# Altium schematic sheet Current_Sensing.SchDoc
size A4; SheetNumber: 6; SheetTotal: 8
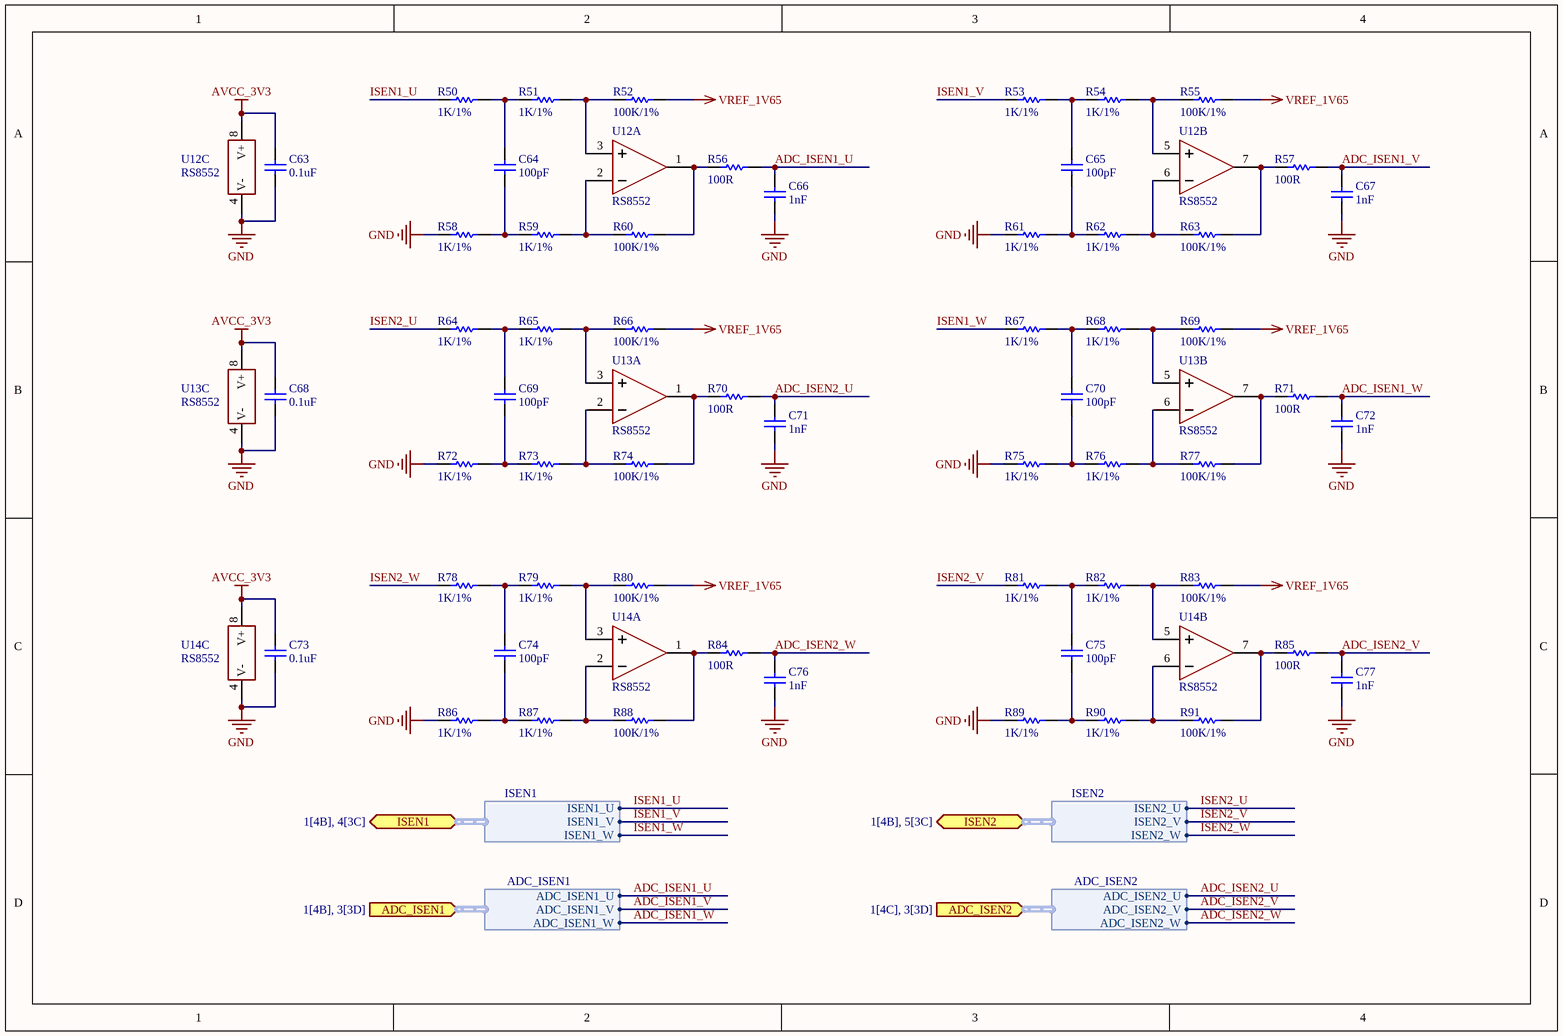
[diagram p0: Current_Sensing.SchDoc]

## Parts
C63  0.1uF  [C0603_NS]
C64  100pF  [C0603_NS]
C65  100pF  [C0603_NS]
C66  1nF  [C0603_NS]
C67  1nF  [C0603_NS]
C68  0.1uF  [C0603_NS]
C69  100pF  [C0603_NS]
C70  100pF  [C0603_NS]
C71  1nF  [C0603_NS]
C72  1nF  [C0603_NS]
C73  0.1uF  [C0603_NS]
C74  100pF  [C0603_NS]
C75  100pF  [C0603_NS]
C76  1nF  [C0603_NS]
C77  1nF  [C0603_NS]
R50  1K/1%  [R0603_NS]
R51  1K/1%  [R0603_NS]
R52  100K/1%  [R0603_NS]
R53  1K/1%  [R0603_NS]
R54  1K/1%  [R0603_NS]
R55  100K/1%  [R0603_NS]
R56  100R  [R0603_NS]
R57  100R  [R0603_NS]
R58  1K/1%  [R0603_NS]
R59  1K/1%  [R0603_NS]
R60  100K/1%  [R0603_NS]
R61  1K/1%  [R0603_NS]
R62  1K/1%  [R0603_NS]
R63  100K/1%  [R0603_NS]
R64  1K/1%  [R0603_NS]
R65  1K/1%  [R0603_NS]
R66  100K/1%  [R0603_NS]
R67  1K/1%  [R0603_NS]
R68  1K/1%  [R0603_NS]
R69  100K/1%  [R0603_NS]
R70  100R  [R0603_NS]
R71  100R  [R0603_NS]
R72  1K/1%  [R0603_NS]
R73  1K/1%  [R0603_NS]
R74  100K/1%  [R0603_NS]
R75  1K/1%  [R0603_NS]
R76  1K/1%  [R0603_NS]
R77  100K/1%  [R0603_NS]
R78  1K/1%  [R0603_NS]
R79  1K/1%  [R0603_NS]
R80  100K/1%  [R0603_NS]
R81  1K/1%  [R0603_NS]
R82  1K/1%  [R0603_NS]
R83  100K/1%  [R0603_NS]
R84  100R  [R0603_NS]
R85  100R  [R0603_NS]
R86  1K/1%  [R0603_NS]
R87  1K/1%  [R0603_NS]
R88  100K/1%  [R0603_NS]
R89  1K/1%  [R0603_NS]
R90  1K/1%  [R0603_NS]
R91  100K/1%  [R0603_NS]
U12  RS8552  [TSSOP8_N]  (parts A,B,C of 3)
U13  RS8552  [TSSOP8_N]  (parts A,B,C of 3)
U14  RS8552  [TSSOP8_N]  (parts A,B,C of 3)

## Ports
ADC_ISEN1 (in, harness ADC_ISEN1, see 1[4B], 3[3D]), ADC_ISEN2 (in, harness ADC_ISEN2, see 1[4C], 3[3D]), ISEN1 (bidir, harness ISEN1, see 1[4B], 4[3C]), ISEN2 (bidir, harness ISEN2, see 1[4B], 5[3C])

## Harnesses
ISEN1: ISEN1_U, ISEN1_V, ISEN1_W
ISEN2: ISEN2_U, ISEN2_V, ISEN2_W
ADC_ISEN1: ADC_ISEN1_W, ADC_ISEN1_V, ADC_ISEN1_U
ADC_ISEN2: ADC_ISEN2_W, ADC_ISEN2_V, ADC_ISEN2_U

## Nets
AVCC_3V3: C63.2 C68.2 C73.2 U12.8(V+) U13.8(V+) U14.8(V+)
GND: C63.1 C66.1 C67.1 C68.1 C71.1 C72.1 C73.1 C76.1 C77.1 R58.1 R61.1 R72.1 R75.1 R86.1 R89.1 U12.4(V-) U13.4(V-) U14.4(V-)
VREF_1V65: R52.2 R55.2 R66.2 R69.2 R80.2 R83.2
ADC_ISEN1_U: C66.2 R56.2 ; port ADC_ISEN1.ADC_ISEN1_U
ADC_ISEN1_V: C67.2 R57.2 ; port ADC_ISEN1.ADC_ISEN1_V
ADC_ISEN1_W: C72.2 R71.2 ; port ADC_ISEN1.ADC_ISEN1_W
ADC_ISEN2_U: C71.2 R70.2 ; port ADC_ISEN2.ADC_ISEN2_U
ADC_ISEN2_V: C77.2 R85.2 ; port ADC_ISEN2.ADC_ISEN2_V
ADC_ISEN2_W: C76.2 R84.2 ; port ADC_ISEN2.ADC_ISEN2_W
ISEN1_U: R50.1 ; port ISEN1.ISEN1_U
ISEN1_V: R53.1 ; port ISEN1.ISEN1_V
ISEN1_W: R67.1 ; port ISEN1.ISEN1_W
ISEN2_U: R64.1 ; port ISEN2.ISEN2_U
ISEN2_V: R81.1 ; port ISEN2.ISEN2_V
ISEN2_W: R78.1 ; port ISEN2.ISEN2_W
NetC64_1: C64.1 R58.2 R59.1
NetC64_2: C64.2 R50.2 R51.1
NetC65_1: C65.1 R61.2 R62.1
NetC65_2: C65.2 R53.2 R54.1
NetC69_1: C69.1 R72.2 R73.1
NetC69_2: C69.2 R64.2 R65.1
NetC70_1: C70.1 R75.2 R76.1
NetC70_2: C70.2 R67.2 R68.1
NetC74_1: C74.1 R86.2 R87.1
NetC74_2: C74.2 R78.2 R79.1
NetC75_1: C75.1 R89.2 R90.1
NetC75_2: C75.2 R81.2 R82.1
NetR51_2: R51.2 R52.1 U12.3(+IN_A)
NetR54_2: R54.2 R55.1 U12.5(+IN_B)
NetR56_1: R56.1 R60.2 U12.1(OUT_A)
NetR57_1: R57.1 R63.2 U12.7(OUT_B)
NetR59_2: R59.2 R60.1 U12.2(-IN_A)
NetR62_2: R62.2 R63.1 U12.6(-IN_B)
NetR65_2: R65.2 R66.1 U13.3(+IN_A)
NetR68_2: R68.2 R69.1 U13.5(+IN_B)
NetR70_1: R70.1 R74.2 U13.1(OUT_A)
NetR71_1: R71.1 R77.2 U13.7(OUT_B)
NetR73_2: R73.2 R74.1 U13.2(-IN_A)
NetR76_2: R76.2 R77.1 U13.6(-IN_B)
NetR79_2: R79.2 R80.1 U14.3(+IN_A)
NetR82_2: R82.2 R83.1 U14.5(+IN_B)
NetR84_1: R84.1 R88.2 U14.1(OUT_A)
NetR85_1: R85.1 R91.2 U14.7(OUT_B)
NetR87_2: R87.2 R88.1 U14.2(-IN_A)
NetR90_2: R90.2 R91.1 U14.6(-IN_B)

## Library data of the parts
C63-C77 = Cap: Capacitor
R50-R91 = Res1: Resistor
U12-U14 = AD8606